# Altium schematic sheet LED_MCU.SchDoc
size A3
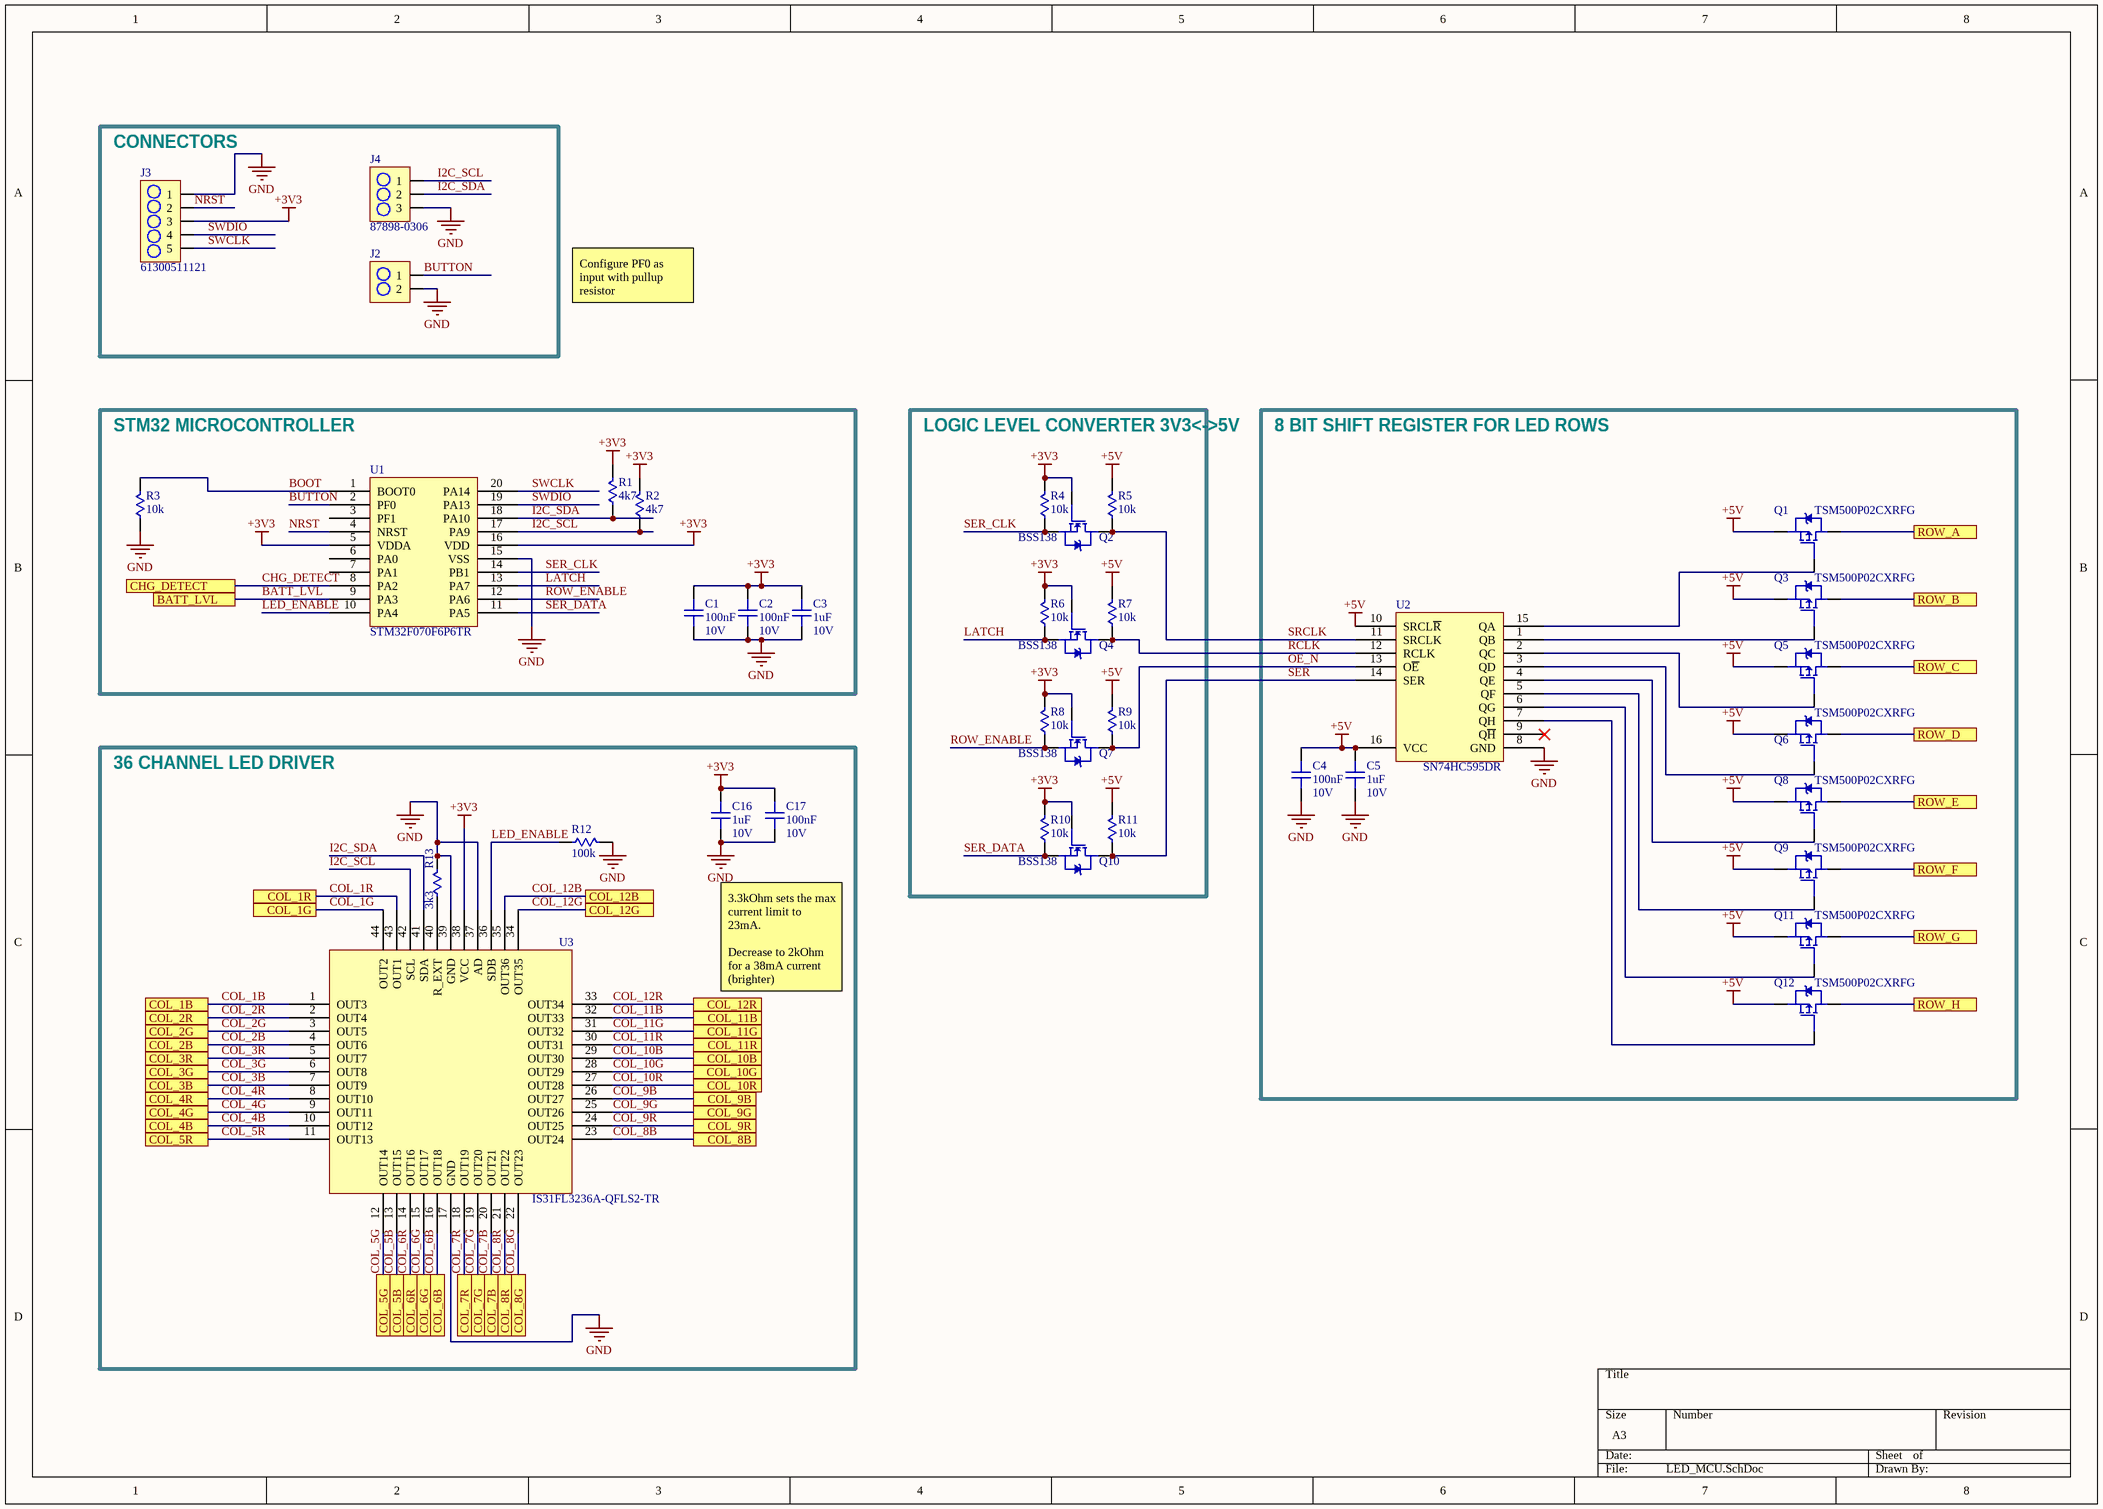
[diagram p0: LED_MCU.SchDoc]

## Parts
C1  100nF  Voltage Rating: 10V  [C0402]
C2  100nF  Voltage Rating: 10V  [C0402]
C3  1uF  Voltage Rating: 10V  [C0402]
C4  100nF  Voltage Rating: 10V  [C0402]
C5  1uF  Voltage Rating: 10V  [C0402]
C16  1uF  Voltage Rating: 10V  [C0402]
C17  100nF  Voltage Rating: 10V  [C0402]
J2  Button Pads  [2PIN_HEADER - BUTTON]  (value not drawn)
J3  61300511121  [5PIN_HEADER]
J4  87898-0306  [3PIN_SMD]
Q1  TSM500P02CXRFG  [SOT23-3_PMOS]
Q2  BSS138  [SOT23-3_PMOS]
Q3  TSM500P02CXRFG  [SOT23-3_PMOS]
Q4  BSS138  [SOT23-3_PMOS]
Q5  TSM500P02CXRFG  [SOT23-3_PMOS]
Q6  TSM500P02CXRFG  [SOT23-3_PMOS]
Q7  BSS138  [SOT23-3_PMOS]
Q8  TSM500P02CXRFG  [SOT23-3_PMOS]
Q9  TSM500P02CXRFG  [SOT23-3_PMOS]
Q10  BSS138  [SOT23-3_PMOS]
Q11  TSM500P02CXRFG  [SOT23-3_PMOS]
Q12  TSM500P02CXRFG  [SOT23-3_PMOS]
R1  4k7  [R0402]
R2  4k7  [R0402]
R3  10k  [R0402]
R4  10k  [R0402]
R5  10k  [R0402]
R6  10k  [R0402]
R7  10k  [R0402]
R8  10k  [R0402]
R9  10k  [R0402]
R10  10k  [R0402]
R11  10k  [R0402]
R12  100k  [R0402]
R13  3k3  [R0402]
U1  STM32F070F6P6TR  [TSSOP-20]
U2  SN74HC595DR  [SOIC-16]
U3  IS31FL3236A-QFLS2-TR  [QFN-44]

## Blocks framed on the sheet
CONNECTORS: J2-J4
STM32 MICROCONTROLLER: C1-C3 R1-R3 U1
LOGIC LEVEL CONVERTER 3V3<->5V: Q2 Q4 Q7 Q10 R4-R11
8 BIT SHIFT REGISTER FOR LED ROWS: C4 C5 Q1 Q3 Q5 Q6 Q8 Q9 Q11 Q12 U2
36 CHANNEL LED DRIVER: C16 C17 R12 R13 U3

## Ports
BATT_LVL, CHG_DETECT, COL_1B, COL_1G, COL_1R, COL_2B, COL_2G, COL_2R, COL_3B, COL_3G, COL_3R, COL_4B, COL_4G, COL_4R, COL_5B, COL_5G, COL_5R, COL_6B, COL_6G, COL_6R, COL_7B, COL_7G, COL_7R, COL_8B, COL_8G, COL_8R, COL_9B, COL_9G, COL_9R, COL_10B, COL_10G, COL_10R, COL_11B, COL_11G, COL_11R, COL_12B, COL_12G, COL_12R, ROW_A, ROW_B, ROW_C, ROW_D, ROW_E, ROW_F, ROW_G, ROW_H

## Nets
+3V3: C1.2 C2.2 C3.2 C16.2 C17.2 J3.3 Q2.1 Q4.1 Q7.1 Q10.1 R1.2 R2.2 R4.2 R6.2 R8.2 R10.2 U1.5(VDDA) U1.16(VDD) U3.38(VCC)
+5V: C4.2 C5.2 Q1.2 Q3.2 Q5.2 Q6.2 Q8.2 Q9.2 Q11.2 Q12.2 R5.2 R7.2 R9.2 R11.2 U2.10(SRCL~{R}) U2.16(VCC)
GND: C1.1 C2.1 C3.1 C4.1 C5.1 C16.1 C17.1 J2.2 J3.1 J4.3 R3.1 R12.2 R13.2 U1.15(VSS) U2.8(GND) U3.17(GND) U3.37(AD) U3.39(GND)
BATT_LVL: U1.9(PA3) ; port BATT_LVL
BOOT: R3.2 U1.1(BOOT0)
BUTTON: J2.1 U1.2(PF0)
CHG_DETECT: U1.8(PA2) ; port CHG_DETECT
COL_1B: U3.1(OUT3) ; port COL_1B
COL_1G: U3.44(OUT2) ; port COL_1G
COL_1R: U3.43(OUT1) ; port COL_1R
COL_2B: U3.4(OUT6) ; port COL_2B
COL_2G: U3.3(OUT5) ; port COL_2G
COL_2R: U3.2(OUT4) ; port COL_2R
COL_3B: U3.7(OUT9) ; port COL_3B
COL_3G: U3.6(OUT8) ; port COL_3G
COL_3R: U3.5(OUT7) ; port COL_3R
COL_4B: U3.10(OUT12) ; port COL_4B
COL_4G: U3.9(OUT11) ; port COL_4G
COL_4R: U3.8(OUT10) ; port COL_4R
COL_5B: U3.13(OUT15) ; port COL_5B
COL_5G: U3.12(OUT14) ; port COL_5G
COL_5R: U3.11(OUT13) ; port COL_5R
COL_6B: U3.16(OUT18) ; port COL_6B
COL_6G: U3.15(OUT17) ; port COL_6G
COL_6R: U3.14(OUT16) ; port COL_6R
COL_7B: U3.20(OUT21) ; port COL_7B
COL_7G: U3.19(OUT20) ; port COL_7G
COL_7R: U3.18(OUT19) ; port COL_7R
COL_8B: U3.23(OUT24) ; port COL_8B
COL_8G: U3.22(OUT23) ; port COL_8G
COL_8R: U3.21(OUT22) ; port COL_8R
COL_9B: U3.26(OUT27) ; port COL_9B
COL_9G: U3.25(OUT26) ; port COL_9G
COL_9R: U3.24(OUT25) ; port COL_9R
COL_10B: U3.29(OUT30) ; port COL_10B
COL_10G: U3.28(OUT29) ; port COL_10G
COL_10R: U3.27(OUT28) ; port COL_10R
COL_11B: U3.32(OUT33) ; port COL_11B
COL_11G: U3.31(OUT32) ; port COL_11G
COL_11R: U3.30(OUT31) ; port COL_11R
COL_12B: U3.35(OUT36) ; port COL_12B
COL_12G: U3.34(OUT35) ; port COL_12G
COL_12R: U3.33(OUT34) ; port COL_12R
I2C_SCL: J4.1 R2.1 U1.17(PA9) U3.42(SCL)
I2C_SDA: J4.2 R1.1 U1.18(PA10) U3.41(SDA)
LATCH: Q4.2 R6.1 U1.13(PA7)
LED_ENABLE: R12.1 U1.10(PA4) U3.36(SDB)
NRST: J3.2 U1.4(NRST)
OE_N: Q7.3 R9.1 U2.13(O~{E})
RCLK: Q4.3 R7.1 U2.12(RCLK)
ROW_A: Q1.3 ; port ROW_A
ROW_B: Q3.3 ; port ROW_B
ROW_C: Q5.3 ; port ROW_C
ROW_D: Q6.3 ; port ROW_D
ROW_E: Q8.3 ; port ROW_E
ROW_ENABLE: Q7.2 R8.1 U1.12(PA6)
ROW_F: Q9.3 ; port ROW_F
ROW_G: Q11.3 ; port ROW_G
ROW_H: Q12.3 ; port ROW_H
SER: Q10.3 R11.1 U2.14(SER)
SER_CLK: Q2.2 R4.1 U1.14(PB1)
SER_DATA: Q10.2 R10.1 U1.11(PA5)
SRCLK: Q2.3 R5.1 U2.11(SRCLK)
SWCLK: J3.5 U1.20(PA14)
SWDIO: J3.4 U1.19(PA13)
NetQ1_1: Q1.1 U2.15(QA)
NetQ3_1: Q3.1 U2.1(QB)
NetQ5_1: Q5.1 U2.2(QC)
NetQ6_1: Q6.1 U2.3(QD)
NetQ8_1: Q8.1 U2.4(QE)
NetQ9_1: Q9.1 U2.5(QF)
NetQ11_1: Q11.1 U2.6(QG)
NetQ12_1: Q12.1 U2.7(QH)
NetR13_1: R13.1 U3.40(R_EXT)

Not connected (* = marked no-connect by the designer): U1 3(PF1) 6(PA0) 7(PA1); U2 9(Q~{H})*

## Notes on the sheet
- Configure PF0 as input with pullup resistor
- 3.3kOhm sets the max current limit to 23mA.
  Decrease to 2kOhm for a 38mA current (brighter)

## Library data of the parts
C1 C2 C4 C17 = CL05A104MP5NNNC: CAP MLCC 0.1uF 10V X5R 0402 20% SMD 0402 85C Paper T/R; Manufacturer: Samsung; Supplier 1: Digi-Key; Manufacturer Part Number: CL05A104MP5NNNC; Stock 1: 100000; Pricing 1: 1=0.1, 10=0.024, 100=0.0106, 500=0.0076, 1000=0.006, 2500=0.0054, 5000=0.005 (USD); Mount: Surface Mount; Case/Package: 0402; Case Code (Metric): 1005; Case Code (Imperial): 0402; Min Operating Temperature: -55°C; Max Operating Temperature: 85°C; Packaging: Tape and Reel; Capacitance: 100nF; Tolerance: 20%; Dielectric: X5R; Voltage Rating (DC): 10V; Length: 1mm; Height: 0.5mm; Width: 0.02inch; Thickness: 0.022inch; Depth: 0.5mm; Radiation Hardening: No; Lead Free: Lead Free; ComponentLink1URL: https://media.digikey.com/pdf/Data%20Sheets/Samsung%20PDFs/CL_Series_MLCC_ds.pdf; ComponentLink1Description: https://media.digikey.com/pdf/Data%20Sheets/Samsung%20PDFs/CL_Series_MLCC_ds.pdf; Supplier Part Number 1: 1276-1443-1-ND
C3 C5 C16 = CL05A105MP5NNNC: CAP MLCC 1uF 10V 0402; Manufacturer: Samsung; Tolerance: 20%; Dielectric: X5R; Supplier 1: Digi-Key; Manufacturer Part Number: CL05A105MP5NNNC; Stock 1: 3892098; Pricing 1: 1=0.1, 10=0.038, 100=0.0169, 500=0.0121, 1000=0.0095, 2500=0.0086, 5000=0.008 (USD); Mount: Surface Mount; Case/Package: 0402; Case Code (Metric): 1005; Case Code (Imperial): 0402; Min Operating Temperature: -55°C; Max Operating Temperature: 85°C; Package Quantity: 1; Packaging: Tape and Reel; Capacitance: 1uF; Voltage Rating (DC): 10V; Length: 1mm; Height: 0.5mm; Width: 0.02inch; Thickness: 0.022inch; Depth: 0.5mm; Radiation Hardening: No; Lead Free: Lead Free; ComponentLink1URL: http://www.samsungsem.com/kr/support/product-search/mlcc/CL05A105MP5NNNC.jsp?src-supplier=Digi-Key; ComponentLink1Description: http://www.samsungsem.com/kr/support/product-search/mlcc/CL05A105MP5NNNC.jsp?src-supplier=Digi-Key; Supplier Part Number 1: 1276-1448-1-ND
J3 = 61300511121: CONN_HeaderPins5pos WURTH ELEKTRONIK         61300511121            Board-To-Board Connector, Vertical, WR-PHD Series, Through Hole, Header, 5 Contacts, 2.54 mm; Manufacturer: Wurth Electronics; Number of Positions: 5; Gender: Male; Connector Type: Male Pin; Pitch: 0.1inch; Supplier 1: Digi-Key; Manufacturer Part Number: 61300511121; Stock 1: 20896; Pricing 1: 1=0.25, 10=0.209, 25=0.174, 50=0.145, 100=0.132, 1000=0.12 (USD); Mount: Through Hole; Contact Plating: Gold; Contact Material: Copper; Color: Black; Number of Rows: 1; Packaging: Bulk; Termination: Solder; Number of Contacts: 5; Contact Mating Length: 0.236inch; REACH SVHC: Unknown; Lead Free: Lead Free; Supplier Part Number 1: 732-5318-ND
J4 = 87898-0306: CONN_3PIN_SMD HDR 3 POS 2.54mm Solder ST SMD SL™ Frame; Manufacturer: Molex; Number of Positions: 3; Gender: Male; Current Rating: 3A; Voltage Rating: 250V; Glow Wire Compliant: Non-compliant; Supplier 1: Digi-Key; Manufacturer Part Number: 87898-0306; Stock 1: 8330; Pricing 1: 1=0.54, 10=0.502, 100=0.3846, 500=0.3344, 1000=0.27588, 5000=0.24244, 10000=0.22572 (USD); Mount: Surface Mount; Contact Plating: Tin; Contact Material: Copper Alloy; Housing Material: Nylon; Material: Copper Alloy; Min Operating Temperature: -55°C; Max Operating Temperature: 105°C; Number of Rows: 1; Packaging: Tray; Package Quantity: 7200; Number of Contacts: 3; Termination: Solder; Orientation: Straight; Number of Circuits: 3; Pitch: 2.54mm; REACH SVHC: No SVHC; Halogen Free: Low Halogen; ELV: Compliant; Flammability Rating: UL94 V-0; ComponentLink1URL: http://www.mouser.com/ds/2/276/0878980306_PCB_HEADERS-176716.pdf?src-supplier=Mouser; ComponentLink1Description: http://www.mouser.com/ds/2/276/0878980306_PCB_HEADERS-176716.pdf?src-supplier=Mouser; Supplier Part Number 1: WM9810-ND
Q1 Q3 Q5 Q6 Q8 Q9 Q11 Q12 = TSM500P02CXRFG: MOSFET P-CH 20V 4.7A 1.56W Rds(ON)=50mOhm; Manufacturer: Taiwan Semiconductor; Rds On Max: 50mR; Input Capacitance: 850pF; Supplier 1: Digi-Key; Manufacturer Part Number: TSM500P02CXRFG; Stock 1: 9267; Pricing 1: 1=0.39, 10=0.309, 100=0.2123, 500=0.1456, 1000=0.1092 (USD); Mount: Surface Mount; Case/Package: SOT-23; Packaging: Tape and Reel; Drain to Source Voltage (Vdss): 20V; Continuous Drain Current (ID): 4.7A; Max Power Dissipation: 1.56W; Supplier Part Number 1: TSM500P02CXRFGCT-ND
Q2 Q4 Q7 Q10 = BSS138: MOSFET N-CH 50V 0.22A 3-Pin SOT-23 T/R; Manufacturer: ON Semiconductor / Fairchild; Rds On Max: 3.5R; Input Capacitance: 27pF; Nominal Vgs: 1.3V; Number of Elements: 1; Max Power Dissipation: 360mW; Rise Time: 9ns; Continuous Drain Current (ID): 220mA; Turn-Off Delay Time: 20ns; Turn-On Delay Time: 2.5ns; Element Configuration: Single; Gate to Source Voltage (Vgs): 20V; On-State Resistance: 6R; Supplier 1: Digi-Key; Manufacturer Part Number: BSS138; Stock 1: 814515; Pricing 1: 1=0.26, 10=0.214, 25=0.1792, 100=0.0876, 500=0.07304, 1000=0.05075 (USD); Mount: Surface Mount; Case/Package: SOT-23; Number of Pins: 3; Weight: 0.03g; Contact Plating: Tin,Matte; Min Operating Temperature: -55°C; Max Operating Temperature: 150°C; Packaging: Tape and Reel; Package Quantity: 1; Dual Supply Voltage: 50V; Drain to Source Voltage (Vdss): 50V; Drain to Source Breakdown Voltage: 50V; Fall Time: 9ns; Drain to Source Resistance: 3.5R; Power Dissipation: 360mW; Threshold Voltage: 1.3V; Termination: SMD/SMT; Voltage Rating (DC): 50V; Current Rating: 220mA; Length: 2.92mm; Height: 0.93mm; Width: 1.3mm; Radiation Hardening: No; REACH SVHC: No SVHC; Lead Free: Lead Free; ComponentLink1URL: https://www.fairchildsemi.com/package-drawings/MA/MA03B.pdf?src-supplier=Digi-Key; ComponentLink1Description: https://www.fairchildsemi.com/package-drawings/MA/MA03B.pdf?src-supplier=Digi-Key; ComponentLink2URL: http://www.farnell.com/datasheets/2304519.pdf?src-supplier=Element14; ComponentLink2Description: http://www.farnell.com/datasheets/2304519.pdf?src-supplier=Element14; ComponentLink3URL: http://www.farnell.com/datasheets/2304519.pdf?src-supplier=Newark; ComponentLink3Description: http://www.farnell.com/datasheets/2304519.pdf?src-supplier=Newark; ComponentLink4URL: https://www.fairchildsemi.com/datasheets/BS/BSS138.pdf?src-supplier=Avnet; ComponentLink4Description: https://www.fairchildsemi.com/datasheets/BS/BSS138.pdf?src-supplier=Avnet; ComponentLink5URL: http://www.fairchildsemi.com/ds/BS/BSS138.pdf?src-supplier=Future+Electronics; ComponentLink5Description: http://www.fairchildsemi.com/ds/BS/BSS138.pdf?src-supplier=Future+Electronics; ComponentLink6URL: http://www.jameco.com/Jameco/Products/ProdDS/784896.pdf?src-supplier=Jameco; ComponentLink6Description: http://www.jameco.com/Jameco/Products/ProdDS/784896.pdf?src-supplier=Jameco; ComponentLink7URL: http://www.fairchildsemi.com/ds/BS/BSS138.pdf?src-supplier=Avnet+Europe; ComponentLink7Description: http://www.fairchildsemi.com/ds/BS/BSS138.pdf?src-supplier=Avnet+Europe; Supplier Part Number 1: BSS138CT-ND
R1 R2 = CRG0402F4K7: RES SMD 4.7K 0402 4.7K Ohm 1% 1/16W ±100ppm/°C Molded SMD SMD; Manufacturer: TE Connectivity; Supplier 1: Newark; Manufacturer Part Number: CRG0402F4K7; Stock 1: 0; Pricing 1: 10000=0.006, 20000=0.003, 200000=0.003, 400000=0.003, 1000000=0.003, 1=0.004, 20000=0.002, 200000=0.002, 400000=0.002, 1000000=0.002 (CAD); Supplier Part Number 1: 30AC5442
R3-R11 = RC0402JR-0710KL: RES SMD 10K OHM 5% 1/16W 0402; Manufacturer: Yageo; Resistance: 10kR; Power Rating: 62.5mW; Voltage Rating: 50V; Temperature Coefficient: 100ppm/°C; Max Power Dissipation: 63mW; Supplier 1: Digi-Key; Manufacturer Part Number: RC0402JR-0710KL; Stock 1: 47303622; Pricing 1: 1=0.1, 10=0.018, 100=0.0073, 1000=0.0033, 2500=0.0029, 5000=0.0024 (USD); Case/Package: 0402; Case Code (Metric): 1005; Case Code (Imperial): 0402; Min Operating Temperature: -55°C; Max Operating Temperature: 155°C; Packaging: Tape and Reel; Tolerance: 5%; Package Quantity: 1; Composition: Thick Film; Number of Terminations: 2; Termination: SMD/SMT; Military Standard: Not; Features: Moisture Resistant; Length: 1mm; Height: 0.016inch; Width: 0.02inch; Depth: 0.5mm; REACH SVHC: Unknown; Lead Free: Lead Free; Supplier Part Number 1: 311-10KJRCT-ND
R12 = RMCF0402FT100K: RES SMD 100K 0402; Manufacturer: Stackpole Electronics; Tolerance: 1%; Resistance: 100kR; Power Rating: 62.5mW; Temperature Coefficient: 100ppm/°C; Max Power Dissipation: 63mW; Supplier 1: Digi-Key; Manufacturer Part Number: RMCF0402FT100K; Stock 1: 796221; Pricing 1: 1=0.1, 10=0.015, 100=0.0061, 1000=0.0028, 2500=0.0024, 5000=0.002 (USD); Mount: Surface Mount; Case/Package: 0402; Case Code (Metric): 1005; Case Code (Imperial): 0402; Contact Plating: Tin,Matte; Min Operating Temperature: -55°C; Max Operating Temperature: 155°C; Packaging: Tape and Reel; Composition: Thick Film; Number of Terminations: 2; Military Standard: Not; Features: Automotive AEC-Q200; Length: 1mm; Height: 0.016inch; Width: 0.02inch; Depth: 0.5mm; Radiation Hardening: No; Lead Free: Lead Free; ComponentLink1URL: https://www.verical.com/server-webapp/html/getDatasheet?partID=482656&src-supplier=Verical; ComponentLink1Description: https://www.verical.com/server-webapp/html/getDatasheet?partID=482656&src-supplier=Verical; Supplier Part Number 1: RMCF0402FT100KCT-ND
R13 = CRCW04023K30FKEDC: RES SMD 3.3K OHM 1% 1/16W 0402; Manufacturer: Vishay; Resistance: 3.3kR; Max Power Dissipation: 63mW; Temperature Coefficient: 100ppm/°C; Supplier 1: Digi-Key; Manufacturer Part Number: CRCW04023K30FKEDC; Stock 1: 19004; Pricing 1: 1=0.1, 10=0.032, 100=0.013, 1000=0.00583, 2500=0.00506, 5000=0.00418 (USD); Case/Package: 0402; Case Code (Imperial): 0402; Case Code (Metric): 1005; Min Operating Temperature: -55°C; Max Operating Temperature: 155°C; Composition: Thick Film; Packaging: Cut Tape; Tolerance: 1%; Number of Terminations: 2; ComponentLink1URL: http://www.vishay.com/docs/28773/crcwce3.pdf?src-supplier=Digi-Key; ComponentLink1Description: http://www.vishay.com/docs/28773/crcwce3.pdf?src-supplier=Digi-Key; Supplier Part Number 1: 541-4080-6-ND
U1 = STM32F070F6P6TR: IC MCU 32BIT 32KB FLASH 20TSSOP; Manufacturer: STMicroelectronics; Interface: I2C,SPI,USB,UART,USART; Peripherals: POR,PWM,WDT,DMA; Core Architecture: ARM; Frequency: 48MHz; Number of I/Os: 15; Oscillator Type: Internal; Supplier 1: Digi-Key; Manufacturer Part Number: STM32F070F6P6TR; Stock 1: 6559; Pricing 1: 1=1.48, 10=1.324, 25=1.2568, 100=1.0322, 250=0.96492, 500=0.85272, 1000=0.6732 (USD); Case/Package: TSSOP; Number of Pins: 20; Min Operating Temperature: -40°C; Max Operating Temperature: 85°C; Memory Type: FLASH; Packaging: Tape and Reel; Memory Size: 32KB; ComponentLink1URL: http://www.farnell.com/datasheets/2281751.pdf?src-supplier=Newark; ComponentLink1Description: http://www.farnell.com/datasheets/2281751.pdf?src-supplier=Newark; ComponentLink2URL: http://www.st.com/content/ccc/resource/technical/document/datasheet/31/4f/10/5f/a5/32/46/42/DM00141386.pdf/files/DM00141386.pdf/jcr:content/translations/en.DM00141386.pdf?src-supplier=Digi-Key; ComponentLink2Description: http://www.st.com/content/ccc/resource/technical/document/datasheet/31/4f/10/5f/a5/32/46/42/DM00141386.pdf/files/DM00141386.pdf/jcr:content/translations/en.DM00141386.pdf?src-supplier=Digi-Key; ComponentLink3URL: http://www.farnell.com/datasheets/2281751.pdf?src-supplier=Farnell; ComponentLink3Description: http://www.farnell.com/datasheets/2281751.pdf?src-supplier=Farnell; Supplier Part Number 1: 497-17354-6-ND
U2 = SN74HC595DR: IC SHIFT REGISTER      SN74HC595DR             Shift Register, HC Family, Serial to Parallel, 1 Element, SOIC, 16 Pins, 2 V, 6 V; Manufacturer: Texas Instruments; Direction: Unidirectional; Max Supply Voltage: 6V; Min Supply Voltage: 2V; Propagation Delay: 250ns; Number of Elements: 1; Operating Supply Voltage: 5V; Frequency: 42MHz; Number of Circuits: 4; Number of Bits: 8; Number of Output Lines: 10; Max Input Current: 1uA; Quiescent Current: 8uA; Supplier 1: Digi-Key; Manufacturer Part Number: SN74HC595DR; Stock 1: 26701; Pricing 1: 1=0.39, 10=0.338, 25=0.3152, 100=0.252, 250=0.234, 500=0.198, 1000=0.153 (USD); Mount: Surface Mount; Case/Package: SOIC; Number of Pins: 16; Weight: 0.004998oz; Contact Plating: Gold; Min Operating Temperature: -40°C; Max Operating Temperature: 85°C; Packaging: Tape and Reel; Package Quantity: 2500; Logic Function: Shift Register; Number of Bits per Element: 8; Turn-On Delay Time: 250ns; Termination: SMD/SMT; Length: 9.9mm; Height: 1.58mm; Width: 3.91mm; Radiation Hardening: No; REACH SVHC: No SVHC; Lead Free: Lead Free; ComponentLink1URL: http://www.ti.com/lit/ds/symlink/sn74hc595.pdf?src-supplier=Digi-Key; ComponentLink1Description: http://www.ti.com/lit/ds/symlink/sn74hc595.pdf?src-supplier=Digi-Key; ComponentLink2URL: http://www.farnell.com/datasheets/1831198.pdf?src-supplier=Element14; ComponentLink2Description: http://www.farnell.com/datasheets/1831198.pdf?src-supplier=Element14; ComponentLink3URL: http://www.farnell.com/datasheets/1886142.pdf?src-supplier=Element14; ComponentLink3Description: http://www.farnell.com/datasheets/1886142.pdf?src-supplier=Element14; ComponentLink4URL: https://www.verical.com/server-webapp/html/getDatasheet?partID=134875&src-supplier=Verical; ComponentLink4Description: https://www.verical.com/server-webapp/html/getDatasheet?partID=134875&src-supplier=Verical; ComponentLink5URL: http://www.farnell.com/datasheets/1905810.pdf?src-supplier=Element14; ComponentLink5Description: http://www.farnell.com/datasheets/1905810.pdf?src-supplier=Element14; ComponentLink6URL: http://www.ti.com/general/docs/lit/getliterature.tsp?genericPartNumber=SN54HC595-SP&&fileType=pdf&src-supplier=Avnet; ComponentLink6Description: http://www.ti.com/general/docs/lit/getliterature.tsp?genericPartNumber=SN54HC595-SP&&fileType=pdf&src-supplier=Avnet; ComponentLink7URL: http://www.jameco.com/Jameco/Products/ProdDS/916385.pdf?src-supplier=Jameco; ComponentLink7Description: http://www.jameco.com/Jameco/Products/ProdDS/916385.pdf?src-supplier=Jameco; ComponentLink8URL: http://www.farnell.com/datasheets/2020588.pdf?src-supplier=Element14; ComponentLink8Description: http://www.farnell.com/datasheets/2020588.pdf?src-supplier=Element14; ComponentLink9URL: http://datasheet.iiic.cc/texas_instruments/SN74HC595DR.pdf?src-supplier=IIIC; ComponentLink9Description: http://datasheet.iiic.cc/texas_instruments/SN74HC595DR.pdf?src-supplier=IIIC; Supplier Part Number 1: 296-14857-6-ND
U3 = IS31FL3236A-QFLS2-TR: IC LED DRVR LINEAR 36CH 44QFN; Manufacturer: ISSI; Dimming: I²C; Number of Outputs: 36; Max Supply Voltage: 5.5V; Output Current per Channel: 38mA; Supplier 1: Digi-Key; Manufacturer Part Number: IS31FL3236A-QFLS2-TR; Stock 1: 6257; Pricing 1: 1=1.65, 10=1.484, 25=1.4, 100=1.12, 250=0.98, 500=0.952, 1000=0.756 (USD); Mount: Surface Mount; Case/Package: QFN; Number of Pins: 44; Min Operating Temperature: -40°C; Max Operating Temperature: 85°C; Packaging: Tape and Reel; ComponentLink1URL: http://www.issi.com/WW/pdf/31FL3236A.pdf?src-supplier=Digi-Key; ComponentLink1Description: http://www.issi.com/WW/pdf/31FL3236A.pdf?src-supplier=Digi-Key; Supplier Part Number 1: 706-1589-1-ND